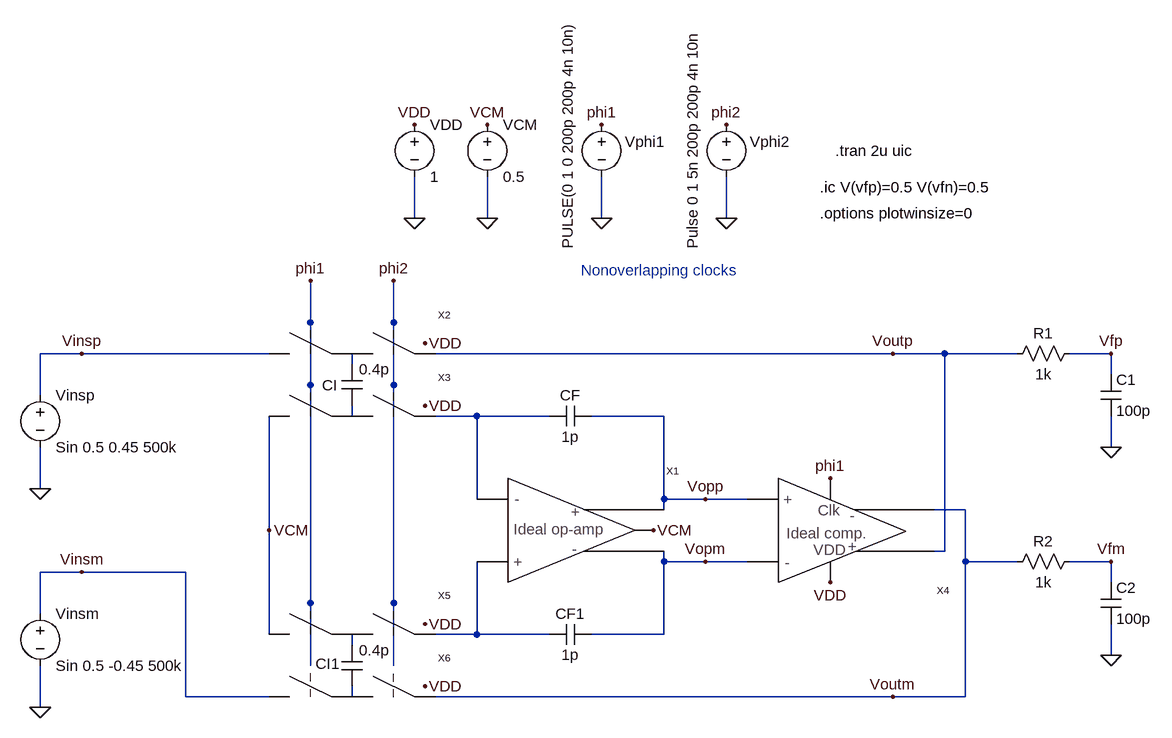
[diagram p0: schematic _Fig7_22_MSD.asc]
_Fig7_22_MSD.asc, the LTspice schematic file:
Version 4
SHEET 1 2740 696
WIRE 1088 -592 1088 -656
WIRE 1200 -592 1200 -656
WIRE 1376 -592 1376 -656
WIRE 1568 -592 1568 -656
WIRE 928 -432 928 -496
WIRE 1056 -432 1056 -496
WIRE 576 -384 512 -384
WIRE 864 -384 576 -384
WIRE 1824 -384 1120 -384
WIRE 1904 -384 1824 -384
WIRE 2016 -384 1904 -384
WIRE 2160 -384 2096 -384
WIRE 992 -368 992 -384
WIRE 2160 -352 2160 -384
WIRE 928 -336 928 -432
WIRE 1056 -336 1056 -432
WIRE 512 -320 512 -384
WIRE 992 -288 992 -304
WIRE 1184 -288 1120 -288
WIRE 1296 -288 1184 -288
WIRE 1472 -288 1360 -288
WIRE 2160 -240 2160 -288
WIRE 512 -176 512 -240
WIRE 1184 -160 1184 -288
WIRE 1472 -160 1472 -288
WIRE 1536 -160 1472 -160
WIRE 1600 -160 1536 -160
WIRE 1472 -144 1472 -160
WIRE 1936 -144 1888 -144
WIRE 864 -112 864 -288
WIRE 1904 -80 1904 -384
WIRE 1904 -80 1888 -80
WIRE 1472 -64 1472 -80
WIRE 1536 -64 1472 -64
WIRE 1600 -64 1536 -64
WIRE 1936 -64 1936 -144
WIRE 2016 -64 1936 -64
WIRE 2160 -64 2096 -64
WIRE 576 -48 512 -48
WIRE 736 -48 576 -48
WIRE 2160 -32 2160 -64
WIRE 928 0 928 -336
WIRE 1056 0 1056 -336
WIRE 512 16 512 -48
WIRE 864 48 864 -112
WIRE 1184 48 1184 -64
WIRE 1184 48 1120 48
WIRE 1296 48 1184 48
WIRE 1472 48 1472 -64
WIRE 1472 48 1360 48
WIRE 992 64 992 48
WIRE 2160 80 2160 32
WIRE 928 96 928 0
WIRE 1056 96 1056 0
WIRE 736 144 736 -48
WIRE 864 144 736 144
WIRE 992 144 992 128
WIRE 1824 144 1120 144
WIRE 1936 144 1936 -64
WIRE 1936 144 1824 144
WIRE 512 160 512 96
FLAG 512 -176 0
FLAG 576 -384 Vinsp
FLAG 1376 -592 0
FLAG 1376 -736 phi1
FLAG 1088 -592 0
FLAG 1088 -736 VDD
FLAG 1104 -400 VDD
FLAG 1104 -304 VDD
FLAG 928 -496 phi1
FLAG 1056 -496 phi2
FLAG 1456 -112 VCM
FLAG 864 -112 VCM
FLAG 1568 -592 0
FLAG 1568 -736 phi2
FLAG 1200 -592 0
FLAG 1200 -736 VCM
FLAG 1728 -32 VDD
FLAG 1728 -192 phi1
FLAG 1824 -384 Voutp
FLAG 1104 32 VDD
FLAG 1104 128 VDD
FLAG 512 160 0
FLAG 576 -48 Vinsm
FLAG 1536 -160 Vopp
FLAG 1536 -64 Vopm
FLAG 2160 -240 0
FLAG 2160 -384 Vfp
FLAG 2160 80 0
FLAG 2160 -64 Vfm
FLAG 1824 144 Voutm
SYMBOL voltage 512 -336 R0
WINDOW 123 0 0 Left 0
WINDOW 39 0 0 Left 0
SYMATTR InstName Vinsp
SYMATTR Value Sin 0.5 0.45 500k
SYMBOL voltage 1376 -752 R0
WINDOW 0 36 42 Left 0
WINDOW 3 -52 207 VLeft 0
WINDOW 123 0 0 Left 0
WINDOW 39 0 0 Left 0
SYMATTR InstName Vphi1
SYMATTR Value PULSE(0 1 0 200p 200p 4n 10n)
SYMBOL voltage 1088 -752 R0
WINDOW 123 0 0 Left 0
WINDOW 39 0 0 Left 0
SYMATTR InstName VDD
SYMATTR Value 1
SYMBOL switches_2 864 -368 R0
SYMATTR InstName X2
SYMBOL switches_2 864 -272 R0
SYMATTR InstName X3
SYMBOL cap 1296 -272 R270
WINDOW 0 32 32 VTop 0
WINDOW 3 0 32 VBottom 0
SYMATTR InstName CF
SYMATTR Value 1p
SYMBOL cap 976 -368 R0
WINDOW 0 -30 33 Left 0
WINDOW 3 27 8 Left 0
SYMATTR InstName CI
SYMATTR Value 0.4p
SYMBOL voltage 1568 -752 R0
WINDOW 0 36 42 Left 0
WINDOW 3 -52 207 VLeft 0
WINDOW 123 0 0 Left 0
WINDOW 39 0 0 Left 0
SYMATTR InstName Vphi2
SYMATTR Value Pulse 0 1 5n 200p 200p 4n 10n
SYMBOL voltage 1200 -752 R0
WINDOW 123 0 0 Left 0
WINDOW 39 0 0 Left 0
SYMATTR InstName VCM
SYMATTR Value 0.5
SYMBOL Ideal_differential_op_amp 1232 -112 R0
SYMATTR InstName X1
SYMBOL cap 1360 32 R90
WINDOW 0 0 32 VBottom 0
WINDOW 3 32 32 VTop 0
SYMATTR InstName CF1
SYMATTR Value 1p
SYMBOL switches_2 864 64 R0
SYMATTR InstName X5
SYMBOL switches_2 864 160 R0
SYMATTR InstName X6
SYMBOL cap 976 64 R0
WINDOW 0 -40 29 Left 0
WINDOW 3 27 8 Left 0
SYMATTR InstName CI1
SYMATTR Value 0.4p
SYMBOL voltage 512 0 R0
WINDOW 123 0 0 Left 0
WINDOW 39 0 0 Left 0
SYMATTR InstName Vinsm
SYMATTR Value Sin 0.5 -0.45 500k
SYMBOL res 2000 -368 R270
WINDOW 0 32 56 VTop 0
WINDOW 3 0 56 VBottom 0
SYMATTR InstName R1
SYMATTR Value 1k
SYMBOL cap 2144 -352 R0
SYMATTR InstName C1
SYMATTR Value 100p
SYMBOL Ideal_differential_clocked_comparator 1648 -112 M180
SYMATTR InstName X4
SYMBOL res 2000 -48 R270
WINDOW 0 32 56 VTop 0
WINDOW 3 0 56 VBottom 0
SYMATTR InstName R2
SYMATTR Value 1k
SYMBOL cap 2144 -32 R0
SYMATTR InstName C2
SYMATTR Value 100p
TEXT 1736 -696 Left 0 !.tran 2u uic
TEXT 1344 -512 Left 0 ;Nonoverlapping clocks
TEXT 1712 -640 Left 0 !.ic V(vfp)=0.5 V(vfn)=0.5
TEXT 1712 -600 Left 0 !.options plotwinsize=0

The netlist it stands for:
* _Fig7_22_MSD.asc
Vinsp Vinsp 0 Sin 0.5 0.45 500k
Vphi1 phi1 0 PULSE(0 1 0 200p 200p 4n 10n)
VDD VDD 0 1
XX2 Vinsp phi1 phi2 Voutp VDD N001 switches_2  ; pins P1 clk1 Clk2 P3 VDD P2
XX3 VCM phi1 phi2 N003 VDD N002 switches_2  ; pins P1 clk1 Clk2 P3 VDD P2
CF N003 Vopp 1p
CI N001 N002 0.4p
Vphi2 phi2 0 Pulse 0 1 5n 200p 200p 4n 10n
VCM VCM 0 0.5
XX1 N003 N004 Vopp VCM Vopm Ideal_differential_op_amp  ; pins Vinm Vinp Outp VCM Outm
CF1 Vopm N004 1p
XX5 VCM phi1 phi2 N004 VDD N005 switches_2  ; pins P1 clk1 Clk2 P3 VDD P2
XX6 Vinsm phi1 phi2 Voutm VDD N006 switches_2  ; pins P1 clk1 Clk2 P3 VDD P2
CI1 N005 N006 0.4p
Vinsm Vinsm 0 Sin 0.5 -0.45 500k
R1 Voutp Vfp 1k
C1 Vfp 0 100p
XX4 Vopm Vopp Voutp VDD phi1 Voutm Ideal_differential_clocked_comparator  ; pins Vinm Vinp Voutp VDD Clock Voutm
R2 Voutm Vfm 1k
C2 Vfm 0 100p
.tran 2u uic
* Nonoverlapping clocks
.ic V(vfp)=0.5 V(vfn)=0.5
.options plotwinsize=0
.backanno
.end